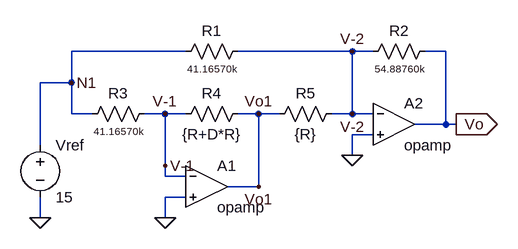
[diagram p0: schematic 3d3.asc]
3d3.asc, the LTspice schematic file:
Version 4
SHEET 1 880 680
WIRE 192 0 16 0
WIRE 448 0 272 0
WIRE 480 0 448 0
WIRE 592 0 560 0
WIRE 16 48 16 0
WIRE 16 48 -32 48
WIRE 16 96 16 48
WIRE 48 96 16 96
WIRE 160 96 128 96
WIRE 192 96 160 96
WIRE 304 96 272 96
WIRE 336 96 304 96
WIRE 448 96 448 0
WIRE 448 96 416 96
WIRE 480 96 448 96
WIRE 592 112 592 0
WIRE 592 112 544 112
WIRE 608 112 592 112
WIRE 480 128 448 128
WIRE -32 144 -32 48
WIRE 448 160 448 128
WIRE 160 176 160 96
WIRE 160 192 160 176
WIRE 192 192 160 192
WIRE 304 208 304 96
WIRE 304 208 256 208
WIRE 192 224 160 224
WIRE -32 256 -32 224
WIRE 160 256 160 224
FLAG 160 256 0
FLAG 448 160 0
FLAG -32 256 0
FLAG 608 112 Vo
IOPIN 608 112 Out
FLAG 304 208 Vo1
FLAG 160 176 V-1
FLAG 448 96 V-2
FLAG 16 48 N1
FLAG 448 0 V-2
FLAG 304 96 Vo1
FLAG 160 96 V-1
SYMBOL Opamps\\opamp 224 144 R0
SYMATTR InstName A1
SYMBOL Opamps\\opamp 512 48 R0
SYMATTR InstName A2
SYMBOL res 144 80 R90
WINDOW 0 0 56 VBottom 2
WINDOW 3 32 56 VTop 1
SYMATTR InstName R3
SYMATTR Value 41.16570k
SYMBOL res 288 80 R90
WINDOW 0 0 56 VBottom 2
WINDOW 3 32 56 VTop 2
SYMATTR InstName R4
SYMATTR Value {R+D*R}
SYMBOL res 432 80 R90
WINDOW 0 0 56 VBottom 2
WINDOW 3 32 56 VTop 2
SYMATTR InstName R5
SYMATTR Value {R}
SYMBOL res 288 -16 R90
WINDOW 0 0 56 VBottom 2
WINDOW 3 32 56 VTop 1
SYMATTR InstName R1
SYMATTR Value 41.16570k
SYMBOL res 576 -16 R90
WINDOW 0 0 56 VBottom 2
WINDOW 3 32 56 VTop 1
SYMATTR InstName R2
SYMATTR Value 54.88760k
SYMBOL voltage -32 128 R0
WINDOW 123 0 0 Left 0
WINDOW 39 0 0 Left 0
SYMATTR InstName Vref
SYMATTR Value 15

The netlist it stands for:
* 3d3.asc
XA1 V-1 0 Vo1 opamp Aol=100K GBW=10Meg  ; pins invin noninvin out
XA2 V-2 0 Vo opamp Aol=100K GBW=10Meg  ; pins invin noninvin out
R3 V-1 N1 41.16570k
R4 Vo1 V-1 {R+D*R}
R5 V-2 Vo1 {R}
R1 V-2 N1 41.16570k
R2 Vo V-2 54.88760k
Vref N1 0 15
.backanno
.end